# Altium schematic sheet 01.SchDoc
size 513 x 386 mm
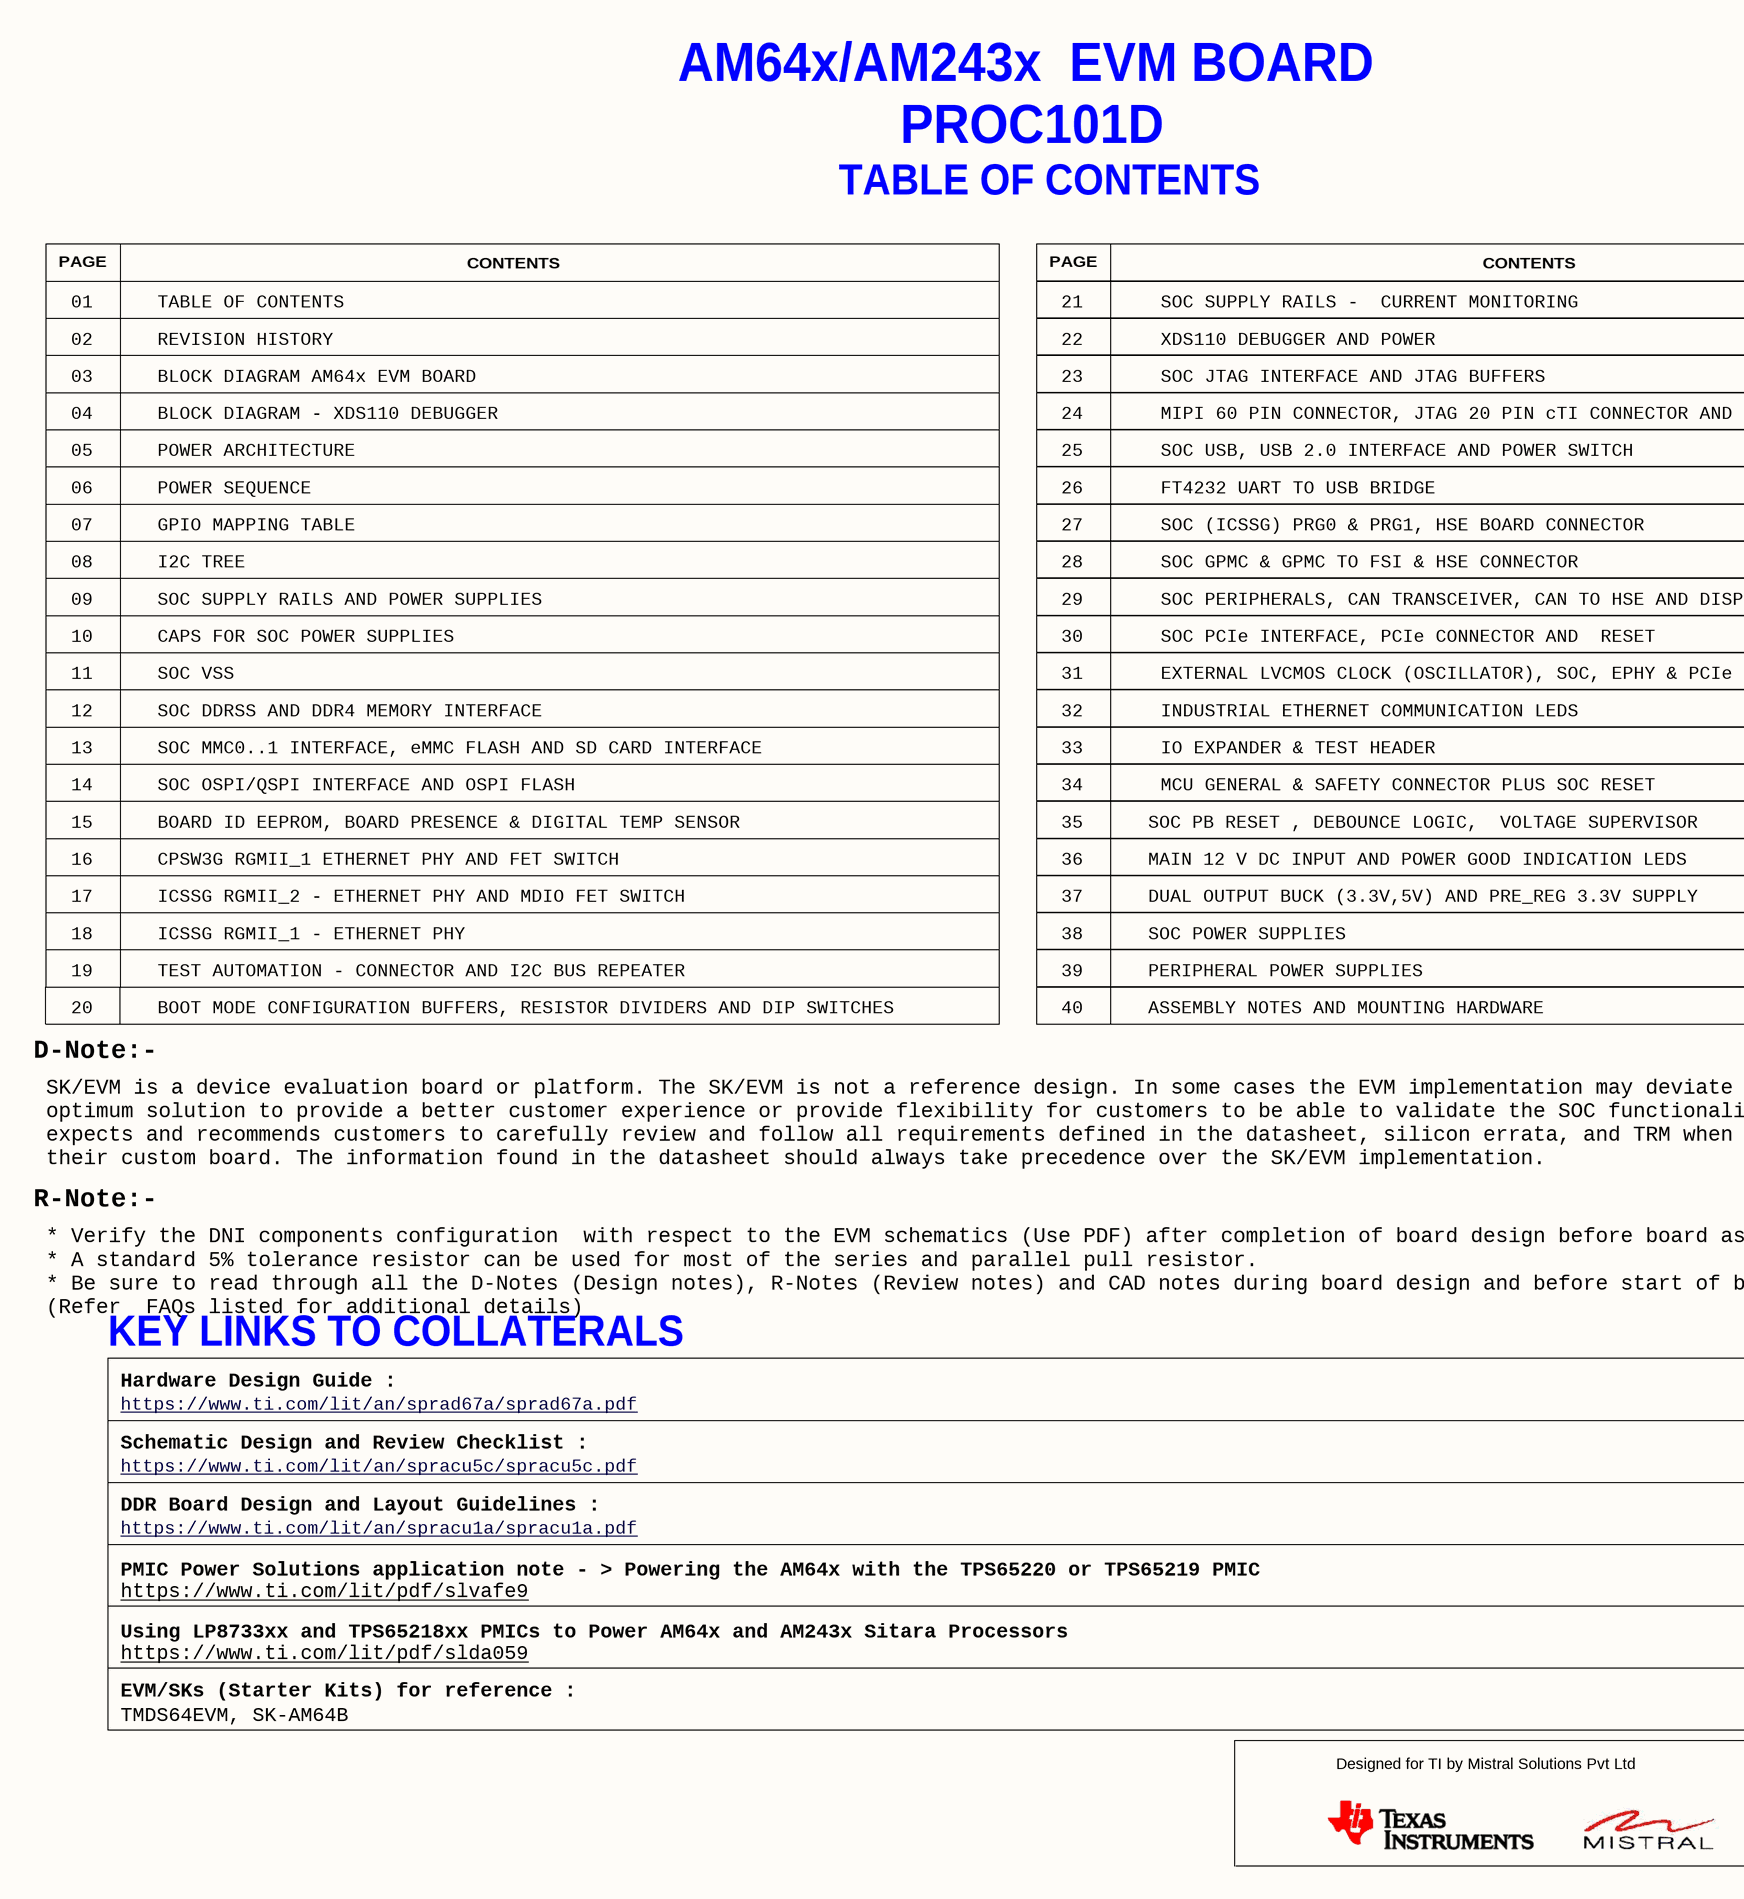
[diagram p0: 01.SchDoc, left]
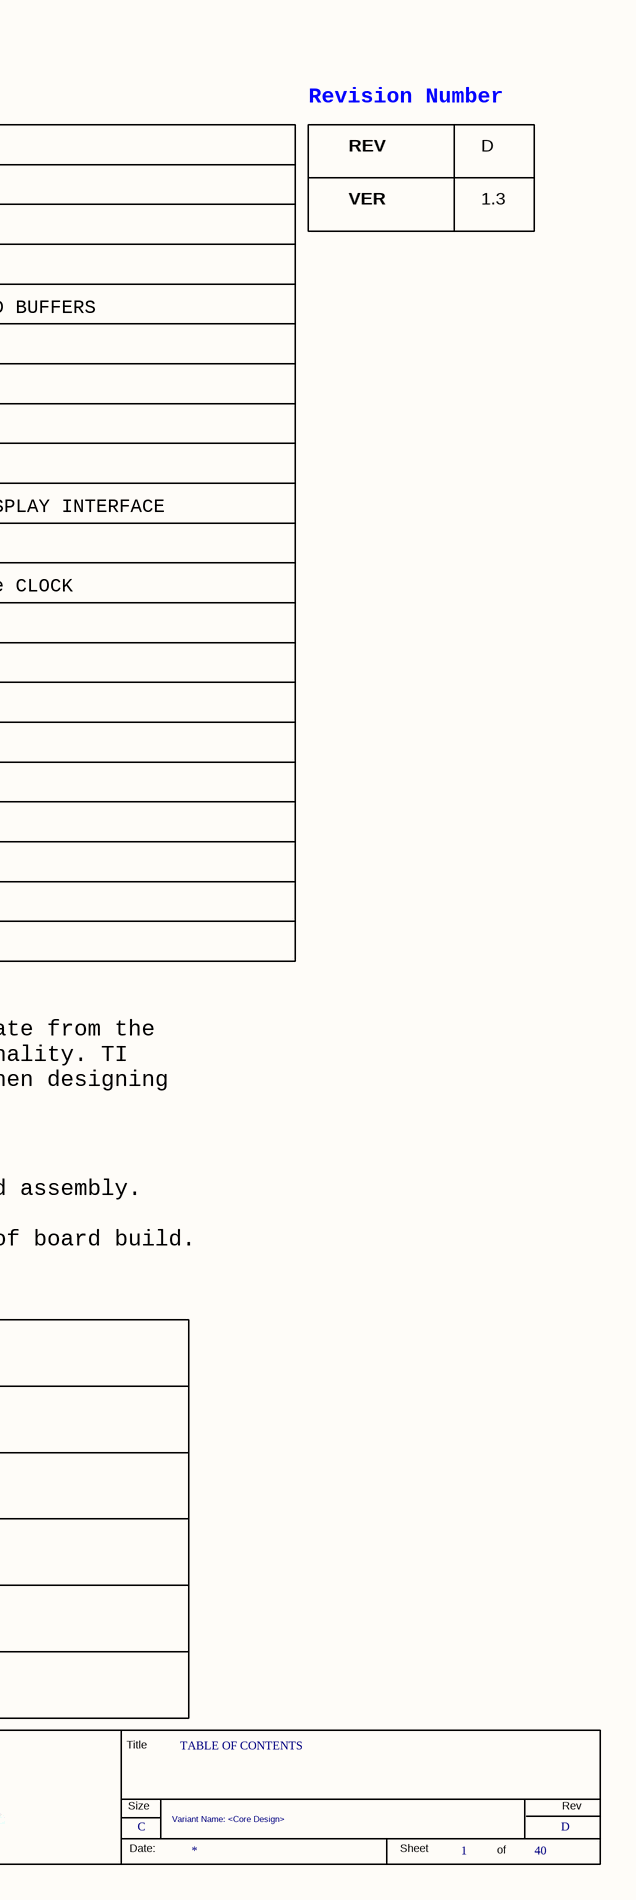
[diagram p1: 01.SchDoc, right]

## Parts
*  RevCode: D  Title: TABLE OF CONTENTS  Page Size: C  Page Number: 1  Page Count: 40  Variant Name: <Core Design>  (hidden comment: MISTRAL_TITLEBLK_CSIZE)  (graphical)

## Notes on the sheet
- AM64x/AM243x  EVM BOARD
- PROC101D
- TABLE OF CONTENTS
- Revision Number
- PAGE
- CONTENTS
- REV
- D
- 01
- 02
- REVISION HISTORY
- 21
- 22
- SOC SUPPLY RAILS -  CURRENT MONITORING
- XDS110 DEBUGGER AND POWER
- VER
- 1.3
- 03
- BLOCK DIAGRAM AM64x EVM BOARD
- 23
- SOC JTAG INTERFACE AND JTAG BUFFERS
- 04
- 05
- BLOCK DIAGRAM - XDS110 DEBUGGER
- POWER ARCHITECTURE
- 24
- 25
- SOC USB, USB 2.0 INTERFACE AND POWER SWITCH
- MIPI 60 PIN CONNECTOR, JTAG 20 PIN cTI CONNECTOR AND BUFFERS
- 07
- 06
- POWER SEQUENCE
- GPIO MAPPING TABLE
- 26
- 27
- SOC (ICSSG) PRG0 & PRG1, HSE BOARD CONNECTOR
- FT4232 UART TO USB BRIDGE
- 08
- I2C TREE
- 28
- SOC GPMC & GPMC TO FSI & HSE CONNECTOR
- 09
- 10
- CAPS FOR SOC POWER SUPPLIES
- SOC SUPPLY RAILS AND POWER SUPPLIES
- 29
- 30
- SOC PERIPHERALS, CAN TRANSCEIVER, CAN TO HSE AND DISPLAY INTERFACE
- SOC PCIe INTERFACE, PCIe CONNECTOR AND  RESET
- 11
- 12
- SOC VSS
- SOC DDRSS AND DDR4 MEMORY INTERFACE
- 31
- 32
- EXTERNAL LVCMOS CLOCK (OSCILLATOR), SOC, EPHY & PCIe CLOCK
- INDUSTRIAL ETHERNET COMMUNICATION LEDS
- 13
- SOC MMC0..1 INTERFACE, eMMC FLASH AND SD CARD INTERFACE
- 33
- IO EXPANDER & TEST HEADER
- 14
- 15
- BOARD ID EEPROM, BOARD PRESENCE & DIGITAL TEMP SENSOR
- SOC OSPI/QSPI INTERFACE AND OSPI FLASH
- 34
- 35
- SOC PB RESET , DEBOUNCE LOGIC,  VOLTAGE SUPERVISOR
- MCU GENERAL & SAFETY CONNECTOR PLUS SOC RESET
- 16
- 17
- ICSSG RGMII_2 - ETHERNET PHY AND MDIO FET SWITCH
- CPSW3G RGMII_1 ETHERNET PHY AND FET SWITCH
- 36
- 37
- DUAL OUTPUT BUCK (3.3V,5V) AND PRE_REG 3.3V SUPPLY
- MAIN 12 V DC INPUT AND POWER GOOD INDICATION LEDS
- 18
- ICSSG RGMII_1 - ETHERNET PHY
- 38
- SOC POWER SUPPLIES
- 20
- 19
- BOOT MODE CONFIGURATION BUFFERS, RESISTOR DIVIDERS AND DIP SWITCHES
- TEST AUTOMATION - CONNECTOR AND I2C BUS REPEATER
- 39
- 40
- PERIPHERAL POWER SUPPLIES
- ASSEMBLY NOTES AND MOUNTING HARDWARE
- D-Note:-
- SK/EVM is a device evaluation board or platform. The SK/EVM is not a reference design. In some cases the EVM implementation may deviate from the
  optimum solution to provide a better customer experience or provide flexibility for customers to be able to validate the SOC functionality. TI
  expects and recommends customers to carefully review and follow all requirements defined in the datasheet, silicon errata, and TRM when designing
  their custom board. The information found in the datasheet should always take precedence over the SK/EVM implementation.
- R-Note:-
- * Verify the DNI components configuration  with respect to the EVM schematics (Use PDF) after completion of board design before board assembly.
  * A standard 5% tolerance resistor can be used for most of the series and parallel pull resistor.
  * Be sure to read through all the D-Notes (Design notes), R-Notes (Review notes) and CAD notes during board design and before start of board build.
  (Refer  FAQs listed for additional details)
- KEY LINKS TO COLLATERALS
- Hardware Design Guide :
- https://www.ti.com/lit/an/sprad67a/sprad67a.pdf
- Schematic Design and Review Checklist :
- https://www.ti.com/lit/an/spracu5c/spracu5c.pdf
- DDR Board Design and Layout Guidelines :
- https://www.ti.com/lit/an/spracu1a/spracu1a.pdf
- PMIC Power Solutions application note - > Powering the AM64x with the TPS65220 or TPS65219 PMIC
- https://www.ti.com/lit/pdf/slvafe9
- Using LP8733xx and TPS65218xx PMICs to Power AM64x and AM243x Sitara Processors
- https://www.ti.com/lit/pdf/slda059
- EVM/SKs (Starter Kits) for reference :
- TMDS64EVM, SK-AM64B
- (in symbol MISTRAL_TITLEBLK_CSIZE) Title; Designed for TI by Mistral Solutions Pvt Ltd; Size; Rev; Date:; Sheet; of

## Library data of the parts
* = MISTRAL_TITLEBLK_CSIZE: Issue: 1.0; Page Create Date: March  8, 1995; Page Modify Date: *